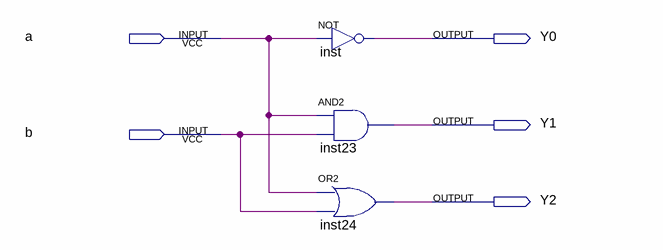
[diagram p0: schematic sheet]
// Quartus schematic 913002.bdf as structural Verilog: 3 symbols, 5 pins
module \913002  (
  input  a,
  input  b,
  output Y0,
  output Y1,
  output Y2
);

  not inst (Y0, a);
  and inst23 (Y1, a, b);
  or inst24 (Y2, a, b);
endmodule
